# EAGLE design macropad_versio2 (EAGLE 9.6.2)
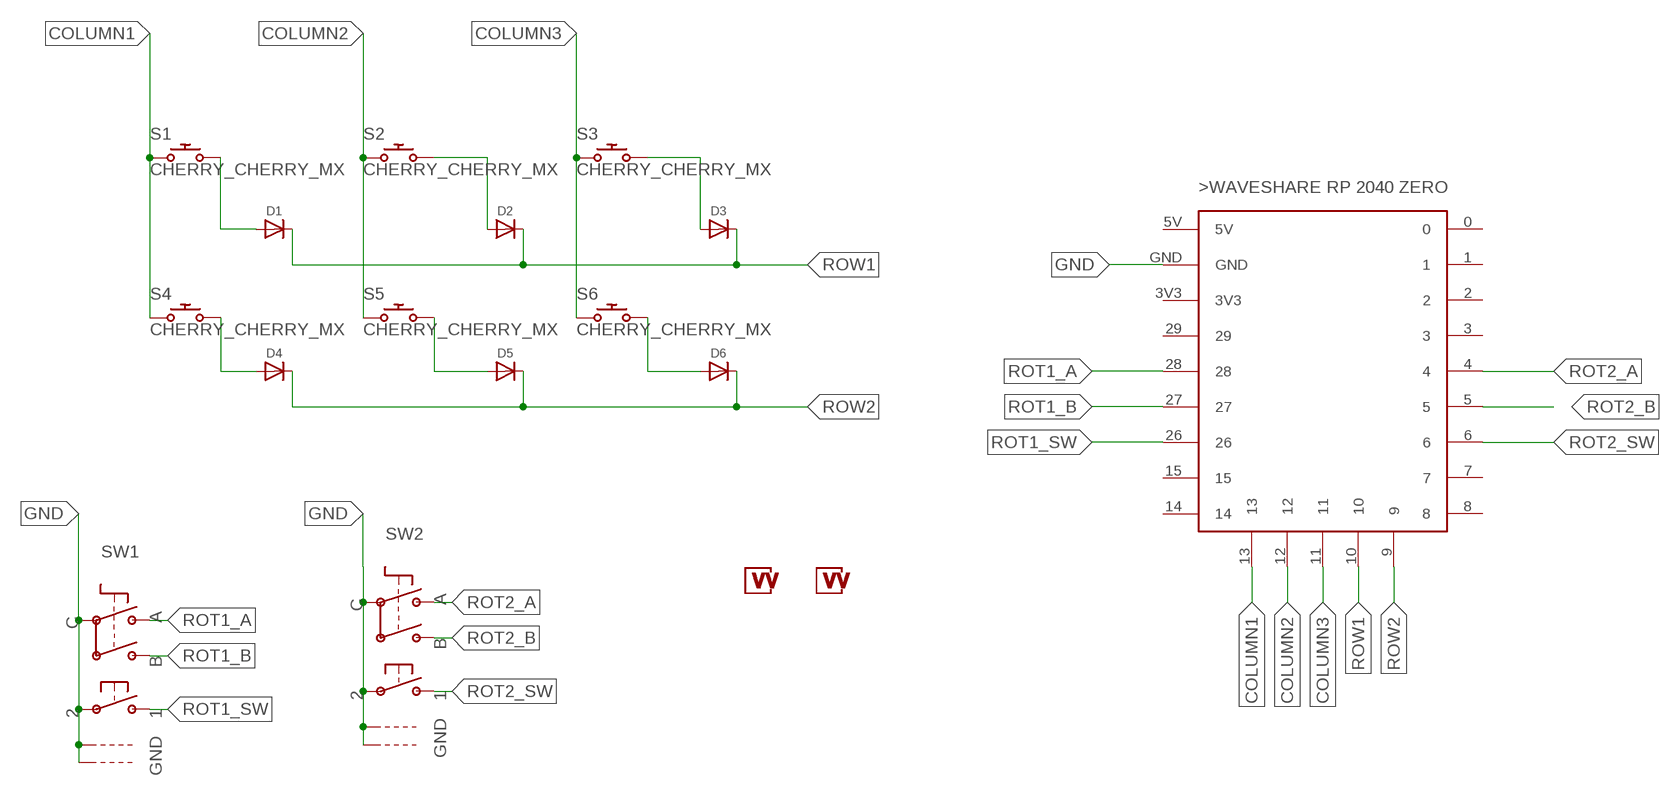
[diagram p0: schematic, sheet 1]

## Parts
D1  ADAFRUIT-MACROPAD-2040_MICROBUILDER_DIODESOD-123  [ADAFRUIT-MACROPAD-2040_MICROBUILDER_SOD-123]
D2  ADAFRUIT-MACROPAD-2040_MICROBUILDER_DIODESOD-123  [ADAFRUIT-MACROPAD-2040_MICROBUILDER_SOD-123]
D3  ADAFRUIT-MACROPAD-2040_MICROBUILDER_DIODESOD-123  [ADAFRUIT-MACROPAD-2040_MICROBUILDER_SOD-123]
D4  ADAFRUIT-MACROPAD-2040_MICROBUILDER_DIODESOD-123  [ADAFRUIT-MACROPAD-2040_MICROBUILDER_SOD-123]
D5  ADAFRUIT-MACROPAD-2040_MICROBUILDER_DIODESOD-123  [ADAFRUIT-MACROPAD-2040_MICROBUILDER_SOD-123]
D6  ADAFRUIT-MACROPAD-2040_MICROBUILDER_DIODESOD-123  [ADAFRUIT-MACROPAD-2040_MICROBUILDER_SOD-123]
RP2040_ZERO1  WAVESHARE_RP2040_ZERO  [WAVESHARE-RP2040-ZERO]
S1  CHERRY_CHERRY_MX  [CHERRY_CHERRY_MX]
S2  CHERRY_CHERRY_MX  [CHERRY_CHERRY_MX]
S3  CHERRY_CHERRY_MX  [CHERRY_CHERRY_MX]
S4  CHERRY_CHERRY_MX  [CHERRY_CHERRY_MX]
S5  CHERRY_CHERRY_MX  [CHERRY_CHERRY_MX]
S6  CHERRY_CHERRY_MX  [CHERRY_CHERRY_MX]
SW1  ADAFRUIT-MACROPAD-2040_ADAFRUIT_ELECTROMECH_ENCODER_PLUS_SWITCH_BOURNS_PEC11  [ADAFRUIT-MACROPAD-2040_ADAFRUIT_ELECTROMECH_PEC11+SWITCH]
SW2  ADAFRUIT-MACROPAD-2040_ADAFRUIT_ELECTROMECH_ENCODER_PLUS_SWITCH_BOURNS_PEC11  [ADAFRUIT-MACROPAD-2040_ADAFRUIT_ELECTROMECH_PEC11+SWITCH]
U$1  LOGO_VV  [VV_MEDUIM]
U$2  LOGO_VV  [VV_MEDUIM]

## Nets
COLUMN1: RP2040_ZERO1.13 S1.S1 S4.S1
COLUMN2: RP2040_ZERO1.12 S2.S1 S5.S1
COLUMN3: RP2040_ZERO1.11 S3.S1 S6.S1
GND: RP2040_ZERO1.GND SW1.P$2 SW1.P$C SW1.P$GND1 SW1.P$GND2 SW2.P$2 SW2.P$C SW2.P$GND1 SW2.P$GND2
N$6: D4.A S4.S2
N$7: D5.A S5.S2
N$8: D6.A S6.S2
N$9: D3.A S3.S2
N$10: D2.A S2.S2
N$11: D1.A S1.S2
ROT1_A: RP2040_ZERO1.28 SW1.P$A
ROT1_B: RP2040_ZERO1.27 SW1.P$B
ROT1_SW: RP2040_ZERO1.26 SW1.P$1
ROT2_A: RP2040_ZERO1.4 SW2.P$A
ROT2_B: RP2040_ZERO1.5 SW2.P$B
ROT2_SW: RP2040_ZERO1.6 SW2.P$1
ROW1: D1.C D2.C D3.C RP2040_ZERO1.10
ROW2: D4.C D5.C D6.C RP2040_ZERO1.9
Unconnected: RP2040_ZERO1.0 RP2040_ZERO1.1 RP2040_ZERO1.2 RP2040_ZERO1.3 RP2040_ZERO1.3V3 RP2040_ZERO1.5V RP2040_ZERO1.7 RP2040_ZERO1.8 RP2040_ZERO1.14 RP2040_ZERO1.15 RP2040_ZERO1.29

## Library data of the parts
D1-D6 = Ocreeb 12:ADAFRUIT-MACROPAD-2040_MICROBUILDER_DIODE: Diode SMA Model Volts Amps Type Vf Ir Digikey # Notes SSA34-E3 40V 3A Schottky 480mV @ 3A 200uA @ 40V SSA34-E3/61TGITR-ND CDBA120-G 20V 1A Schottky 500mV @ 1A 500uA @ 20V 641-1014-6-ND REEL MBRA210 10V 2A Schottky 350mV @ 2A 700uA @ 10V MBRA210LT3 SOD-123 Model Volts Amps Type Vf Ir Order # Notes BAT54T1G 30V 200mA Schottky 800mV @ 200mA 2uA @ 25V BAT54T1GOSTR-ND B0530W 30V 500mA Schottky 430mV @ 500mA 130uA @ 30V B0530W-FDICT-ND REEL MBR120 20V 1A Schottky 340mV @ 1A MBR120VLSFT1GOSCT-ND SOD-323 Model Volts Amps Type Vf Ir Order # Notes PMEG2005EJ 20V 500mA Schottky 355mV @ 500mA 568-4110-1-ND ZLLS410 10V 570mA Schottky 380mV @ 570mA ZLLS410CT-ND 1N4148WS 75V 150mA Silicon/Simple 1V 1N4148WSFSCT-ND REEL SOD-523 Model Volts Amps Type Vf Ir Order # Notes BAT54XV2 30V 200mA Schottky 0.8V @ 100mA BAT54XV2CT-ND TB751S 30V 30mA Schottky RB751S-40TE61CT-ND SOT23-R/W (R = Solder Paste/Reflow Ovens, W = Hand-Soldering) Model Volts Amps Type Vf Ir Order # Notes BAT54FILM 40V 300mA Schottky 497-7162-1-ND POWERDI-5 Model Volts Amps Type Vf Ir Order # Notes PDS560 60V 5A Schottky 670mV @ 5A 150uA @ 60V PDS560DICT-ND
RP2040_ZERO1 = Waveshare_RP2040_zero:WAVESHARE_RP2040_ZERO
S1-S6 = Ocreeb 12:CHERRY_CHERRY_MX: Cherry keymodule MX; FARNELL: 2292961; MOUSER: 540-MX1A-11NW
SW1 SW2 = Ocreeb 12:ADAFRUIT-MACROPAD-2040_ADAFRUIT_ELECTROMECH_ENCODER_PLUS_SWITCH: Rotary Encoder with Built-In Switch PEC11 - 24 Step, PEC11-4215F-S24 - http://www.adafruit.com/products/377
U$1 U$2 = Waveshare_RP2040_zero:LOGO_VV: Logo VV

## Board
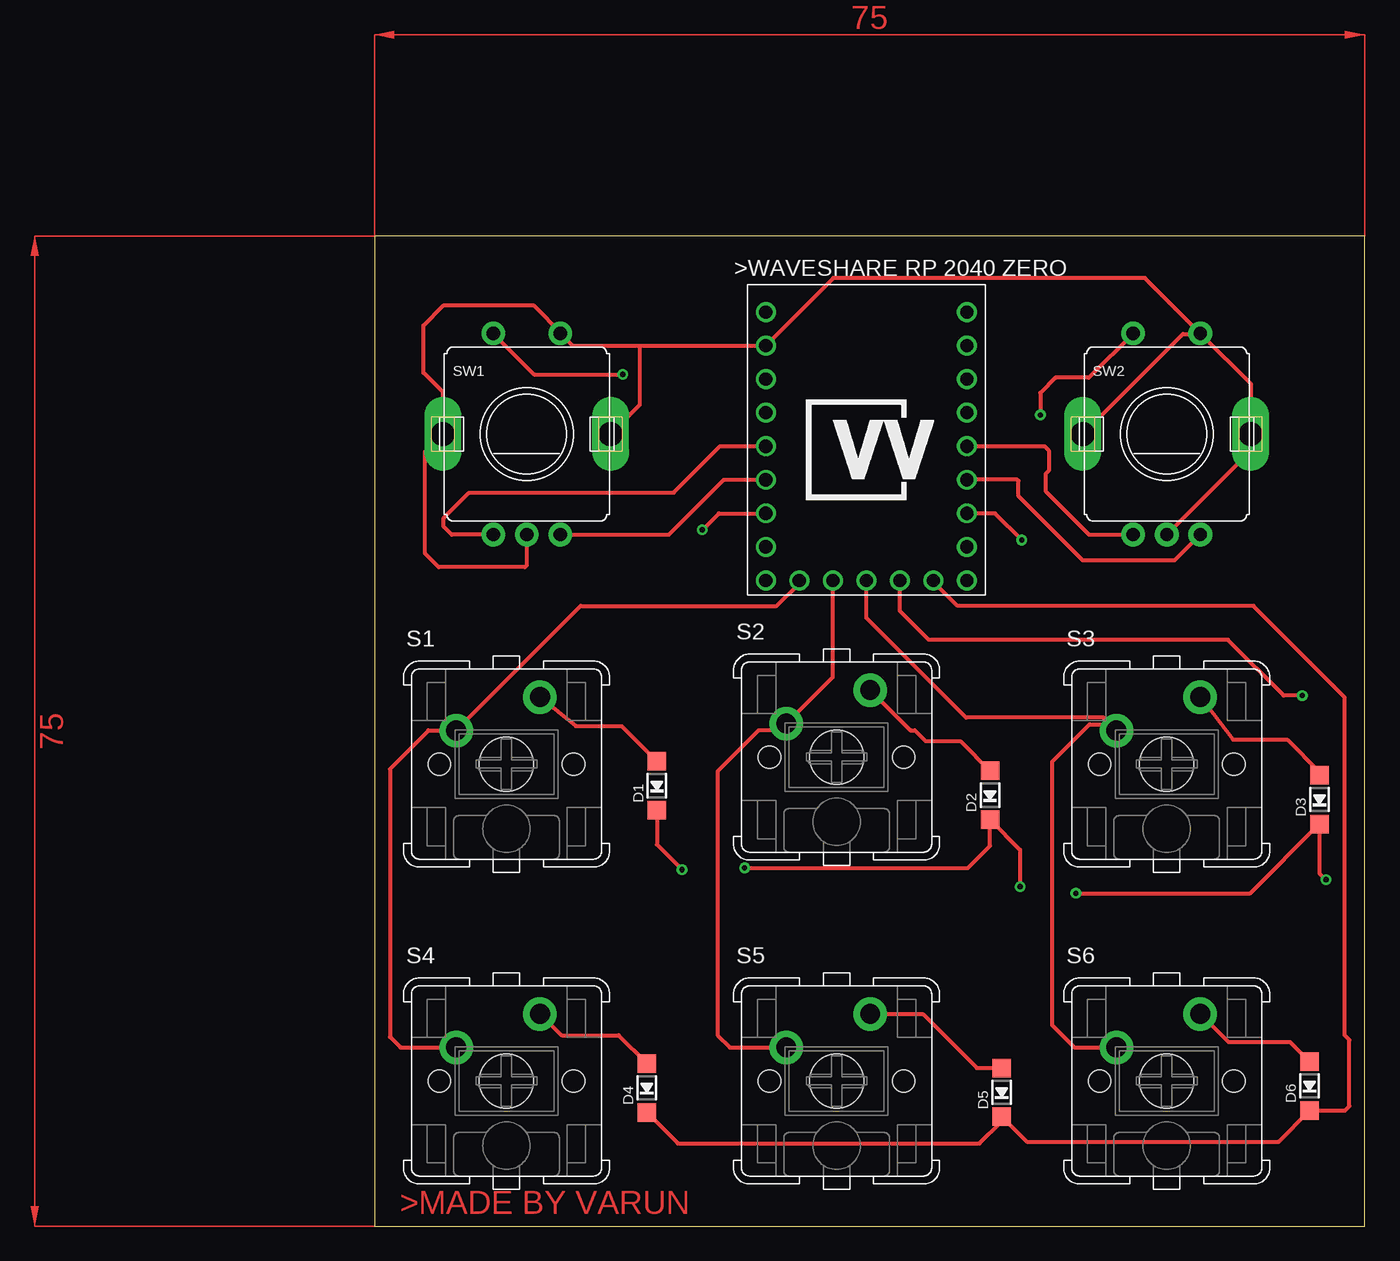
[diagram p1: board, top side]
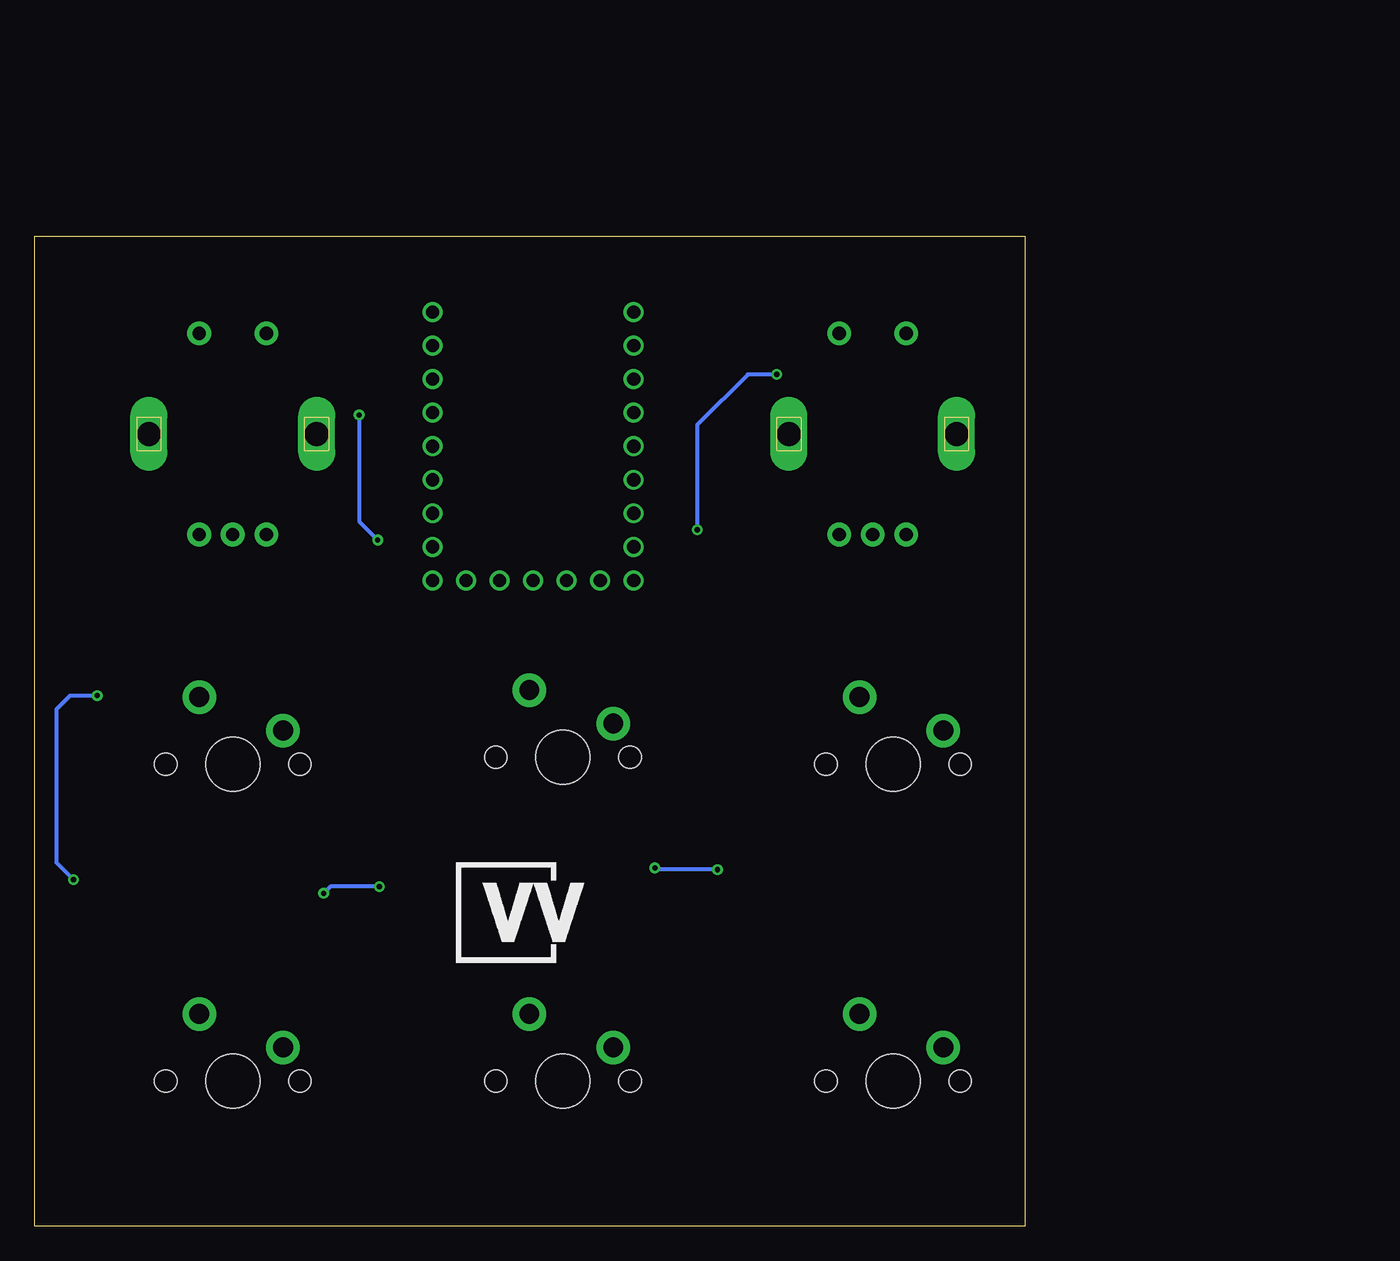
[diagram p2: board, bottom side, seen from below]

Size 75 x 75 mm. Coordinates in mm from the lower left corner, seen from the top.
Outline: 0,0 75,0 75,75 0,75 0,0
Copper layers (1*16): Top 0.035mm / dielectric 1.5mm / Bottom 0.035mm
Design rules "default": minimum track width 6mil, minimum drill 0.35mm, track to track 6mil, track to pad 6mil, pad to pad 6mil, via to via 6mil, smd to smd 6mil, copper to edge 40mil, drill to drill 6mil, minimum pad ring 10mil, minimum via ring 8mil, stop-mask expansion 4mil, vias tented up to drill 0mil, thermal gap 10mil

### Footprints (pad centres in the part's own frame; a part is rotated, then mirrored left to right if it is on the bottom)
ADAFRUIT-MACROPAD-2040_MICROBUILDER_SOD-123 = smd 1.4 x 1.4: A 1.85,0; C -1.85,0
WAVESHARE-RP2040-ZERO = drill 1: 0 16.62,21.41; 1 16.62,18.87; 2 16.62,16.33; 3 16.62,13.79; 3V3 1.38,16.33; 4 16.62,11.25; 5 16.62,8.71; 5V 1.38,21.41; 6 16.62,6.17; 7 16.62,3.63; 8 16.62,1.09; 9 14.08,1.09; 10 11.54,1.09; 11 9,1.09; 12 6.46,1.09; 13 3.92,1.09; 14 1.38,1.09; 15 1.38,3.63; 26 1.38,6.17; 27 1.38,8.71; 28 1.38,11.25; 29 1.38,13.79; GND 1.38,18.87
CHERRY_CHERRY_MX = drill 1.5 pad 2.54: S1 -3.81,2.54; S2 2.54,5.08 | hole 1.7: -5.08,0; 5.08,0 | hole 4.1: 0,0
ADAFRUIT-MACROPAD-2040_ADAFRUIT_ELECTROMECH_PEC11+SWITCH = drill 1 pad 1.8: P$1 -2.54,7.62; P$2 2.54,7.62; P$A -2.54,-7.62; P$B 2.54,-7.62; P$C 0,-7.62 | drill 1.8 pad 2.8 long: P$GND1 -6.35,0; P$GND2 6.35,0

### Placement (x,y rotation side)
D1  21.39,33.36 90 top
D2  46.61,32.65 90 top
D3  71.57,32.31 90 top
D4  20.63,10.47 90 top
D5  47.51,10.14 90 top
D6  70.81,10.63 90 top
RP2040_ZERO1  28.26,47.82 0 top
S1  10,35 0 top
S2  35,35.53 0 top
S3  60,35 0 top
S4  10,11 0 top
S5  35,11 0 top
S6  60,11 0 top
SW1  11.54,60 0 top
SW2  60,60 0 top
U$1  38.54,57.32 0 top
U$2  37.25,22.27 0 bottom

### Tracks (layer width: path | path; a pad name or v marks a point on that pad's centre or on a via)
COLUMN1
  Top 0.305: S4.S1 1.96,13.54 1.17,14.34 1.17,34.63 4.08,37.55 S1.S1 15.63,46.98 30.46,46.98 32.18,48.69 RP2040_ZERO1.13
COLUMN2
  Top 0.305: S5.S1 26.91,13.54 25.98,14.46 25.98,34.45 29.08,37.55 30.67,37.55 S2.S1 34.72,41.6 RP2040_ZERO1.12
COLUMN3
  Top 0.305: S6.S1 53.02,13.54 51.33,15.23 51.33,35.2 54.14,38.02 55.71,38.02 S3.S1 55.2,38.53 44.8,38.53 37.26,46.07 RP2040_ZERO1.11
GND
  Top 0.305: SW1.P$2 14.22,67.47 | 14.22,67.47 15,66.69 20.1,66.69 | 20.1,66.69 RP2040_ZERO1.GND 34.75,71.81 58.35,71.81 SW2.P$2 62.58,67.58 | SW1.P$C 11.54,50.06 11.39,49.92 4.86,49.92 3.84,50.94 3.84,58.65 SW1.P$GND1 5.19,63.17 3.71,64.64 3.71,68.22 5.25,69.76 12.03,69.76 14.22,67.57 14.22,67.47 | SW1.P$GND2 20.1,62.21 20.1,66.69 | 62.58,67.58 66.35,63.81 SW2.P$GND2 66.35,58.73 SW2.P$C | SW2.P$GND1 61.23,67.58 62.58,67.58
N$6
  Top 0.305: S4.S2 14.16,14.46 18.49,14.46 D4.A
N$7
  Top 0.305: S5.S2 41.52,16.08 45.61,11.99 D5.A
N$8
  Top 0.305: S6.S2 64.67,13.95 69.34,13.95 D6.A
N$9
  Top 0.305: S3.S2 65.02,36.86 69.12,36.86 71.57,34.41 D3.A
N$10
  Top 0.305: S2.S2 40.6,37.55 40.92,37.55 41.73,36.74 44.37,36.74 D2.A
N$11
  Top 0.305: S1.S2 15.26,37.89 18.72,37.89 D1.A
ROT1_A
  Top 0.305: SW1.P$A 5.86,52.38 5.25,52.99 5.25,53.63 7.17,55.55 22.66,55.55 26.18,59.07 RP2040_ZERO1.28
ROT1_B
  Top 0.305: SW1.P$B 22.3,52.38 26.45,56.53 RP2040_ZERO1.27
ROT1_SW  (via drill 0.4)
  Top 0.305: SW1.P$1 12.1,64.51 v18.82,64.51 | v24.83,52.74 26.09,53.99 RP2040_ZERO1.26
  Bottom 0.305: v18.82,64.51 20.99,64.51 24.83,60.67 v24.83,52.74
ROT2_A
  Top 0.305: RP2040_ZERO1.4 50.75,59.07 51.07,58.75 51.07,57.22 50.82,56.96 50.82,55.68 54.12,52.38 SW2.P$A
ROT2_B
  Top 0.305: SW2.P$B 60.59,50.43 53.63,50.43 48.77,55.3 48.77,56.45 48.68,56.53 RP2040_ZERO1.5
ROT2_SW  (via drill 0.4)
  Top 0.305: SW2.P$1 54.1,64.26 51.58,64.26 50.43,63.1 v50.43,61.44 | v49.02,51.97 47,53.99 RP2040_ZERO1.6
  Bottom 0.305: v50.43,61.44 50.43,53.38 v49.02,51.97
ROW1  (via drill 0.4)
  Top 0.305: D1.C 21.39,28.91 v23.3,27.01 | v28.03,27.14 44.93,27.14 46.61,28.82 D2.C 48.9,28.51 v48.9,25.73 | v53.12,25.22 66.32,25.22 D3.C 71.57,26.73 v72.06,26.24 | v70.27,40.19 68.86,40.19 64.64,44.42 41.98,44.42 39.8,46.6 RP2040_ZERO1.10
  Bottom 0.305: v23.3,27.01 28.03,27.01 v28.03,27.14 | v48.9,25.73 52.61,25.73 v53.12,25.22 | v72.06,26.24 73.34,27.52 73.34,39.17 72.32,40.19 v70.27,40.19
ROW2
  Top 0.305: D4.C 22.98,6.27 45.82,6.27 47.51,7.95 D5.C 49.4,6.4 68.48,6.4 70.81,8.73 D6.C 73.52,8.78 73.83,9.09 73.83,14.1 73.47,14.46 73.47,40.06 66.56,46.98 44.16,46.98 42.34,48.8 RP2040_ZERO1.9
(copper drawn outside any net)
  shapes: Top area x2

### Text on the board
Top: >MADE BY VARUN